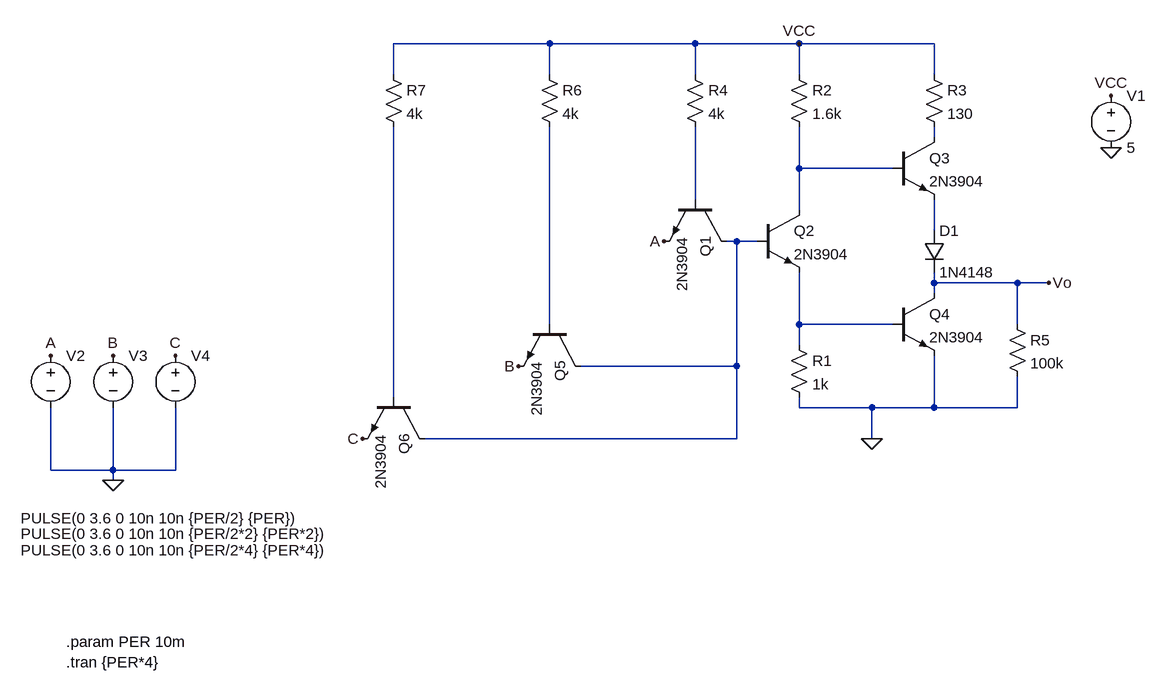
[diagram p0: schematic TTL_NAND.asc]
TTL_NAND.asc, the LTspice schematic file:
Version 4
SHEET 1 880 904
WIRE -304 -64 -544 -64
WIRE -80 -64 -304 -64
WIRE 80 -64 -80 -64
WIRE 288 -64 80 -64
WIRE -544 -16 -544 -64
WIRE -304 -16 -304 -64
WIRE -80 -16 -80 -64
WIRE 80 -16 80 -64
WIRE 288 -16 288 -64
WIRE 288 80 288 64
WIRE 80 128 80 64
WIRE 224 128 80 128
WIRE -80 176 -80 64
WIRE 80 192 80 128
WIRE 288 224 288 176
WIRE -16 240 -32 240
WIRE 16 240 -16 240
WIRE 288 304 288 288
WIRE 416 304 288 304
WIRE 464 304 416 304
WIRE 288 320 288 304
WIRE -304 368 -304 64
WIRE 80 368 80 288
WIRE 224 368 80 368
WIRE 416 368 416 304
WIRE 80 400 80 368
WIRE -16 432 -16 240
WIRE -16 432 -256 432
WIRE -544 480 -544 64
WIRE 80 496 80 480
WIRE 192 496 80 496
WIRE 288 496 288 416
WIRE 288 496 192 496
WIRE 416 496 416 448
WIRE 416 496 288 496
WIRE -16 544 -16 432
WIRE -16 544 -496 544
WIRE 192 544 192 496
WIRE -1072 592 -1072 496
WIRE -976 592 -976 496
WIRE -976 592 -1072 592
WIRE -880 592 -880 496
WIRE -880 592 -976 592
WIRE -976 608 -976 592
FLAG 192 544 0
FLAG 464 304 Vo
FLAG 80 -64 VCC
FLAG 560 96 0
FLAG 560 16 VCC
FLAG -976 608 0
FLAG -1072 416 A
FLAG -976 416 B
FLAG -880 416 C
FLAG -128 240 A
FLAG -352 432 B
FLAG -592 544 C
SYMBOL npn -32 176 R90
SYMATTR InstName Q1
SYMATTR Value 2N3904
SYMBOL npn 16 192 R0
SYMATTR InstName Q2
SYMATTR Value 2N3904
SYMBOL npn 224 80 R0
SYMATTR InstName Q3
SYMATTR Value 2N3904
SYMBOL npn 224 320 R0
SYMATTR InstName Q4
SYMATTR Value 2N3904
SYMBOL diode 272 224 R0
SYMATTR InstName D1
SYMATTR Value 1N4148
SYMBOL res 64 384 R0
SYMATTR InstName R1
SYMATTR Value 1k
SYMBOL res 64 -32 R0
SYMATTR InstName R2
SYMATTR Value 1.6k
SYMBOL res 272 -32 R0
SYMATTR InstName R3
SYMATTR Value 130
SYMBOL res -96 -32 R0
SYMATTR InstName R4
SYMATTR Value 4k
SYMBOL res 400 352 R0
SYMATTR InstName R5
SYMATTR Value 100k
SYMBOL voltage 560 0 R0
WINDOW 123 0 0 Left 0
WINDOW 39 0 0 Left 0
SYMATTR InstName V1
SYMATTR Value 5
SYMBOL voltage -1072 400 R0
WINDOW 3 -46 266 Left 2
WINDOW 123 0 0 Left 0
WINDOW 39 0 0 Left 0
SYMATTR Value PULSE(0 3.6 0 10n 10n {PER/2} {PER})
SYMATTR InstName V2
SYMBOL voltage -976 400 R0
WINDOW 3 -142 290 Left 2
WINDOW 123 0 0 Left 0
WINDOW 39 0 0 Left 0
SYMATTR Value PULSE(0 3.6 0 10n 10n {PER/2*2} {PER*2})
SYMATTR InstName V3
SYMBOL voltage -880 400 R0
WINDOW 3 -238 315 Left 2
WINDOW 123 0 0 Left 0
WINDOW 39 0 0 Left 0
SYMATTR Value PULSE(0 3.6 0 10n 10n {PER/2*4} {PER*4})
SYMATTR InstName V4
SYMBOL npn -256 368 R90
SYMATTR InstName Q5
SYMATTR Value 2N3904
SYMBOL res -320 -32 R0
SYMATTR InstName R6
SYMATTR Value 4k
SYMBOL npn -496 480 R90
SYMATTR InstName Q6
SYMATTR Value 2N3904
SYMBOL res -560 -32 R0
SYMATTR InstName R7
SYMATTR Value 4k
TEXT -1048 856 Left 2 !.param PER 10m
TEXT -1048 888 Left 2 !.tran {PER*4}

The netlist it stands for:
* TTL_NAND.asc
Q1 N005 N003 A 0 2N3904
Q2 N002 N005 N007 0 2N3904
Q3 N001 N002 N004 0 2N3904
Q4 Vo N007 0 0 2N3904
D1 N004 Vo 1N4148
R1 N007 0 1k
R2 VCC N002 1.6k
R3 VCC N001 130
R4 VCC N003 4k
R5 Vo 0 100k
V1 VCC 0 5
V2 A 0 PULSE(0 3.6 0 10n 10n {PER/2} {PER})
V3 B 0 PULSE(0 3.6 0 10n 10n {PER/2*2} {PER*2})
V4 C 0 PULSE(0 3.6 0 10n 10n {PER/2*4} {PER*4})
Q5 N005 N006 B 0 2N3904
R6 VCC N006 4k
Q6 N005 N008 C 0 2N3904
R7 VCC N008 4k
.model D D
.lib standard.dio
.model NPN NPN
.model PNP PNP
.lib standard.bjt
.param PER 10m
.tran {PER*4}
.backanno
.end